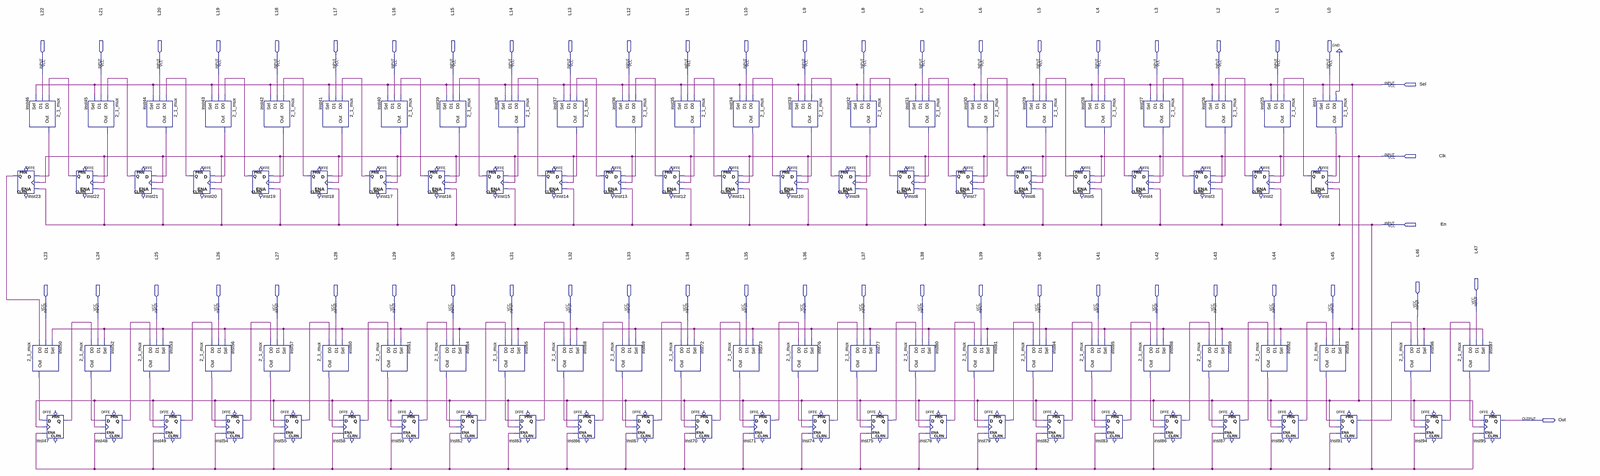
[diagram p0: schematic sheet, whole]
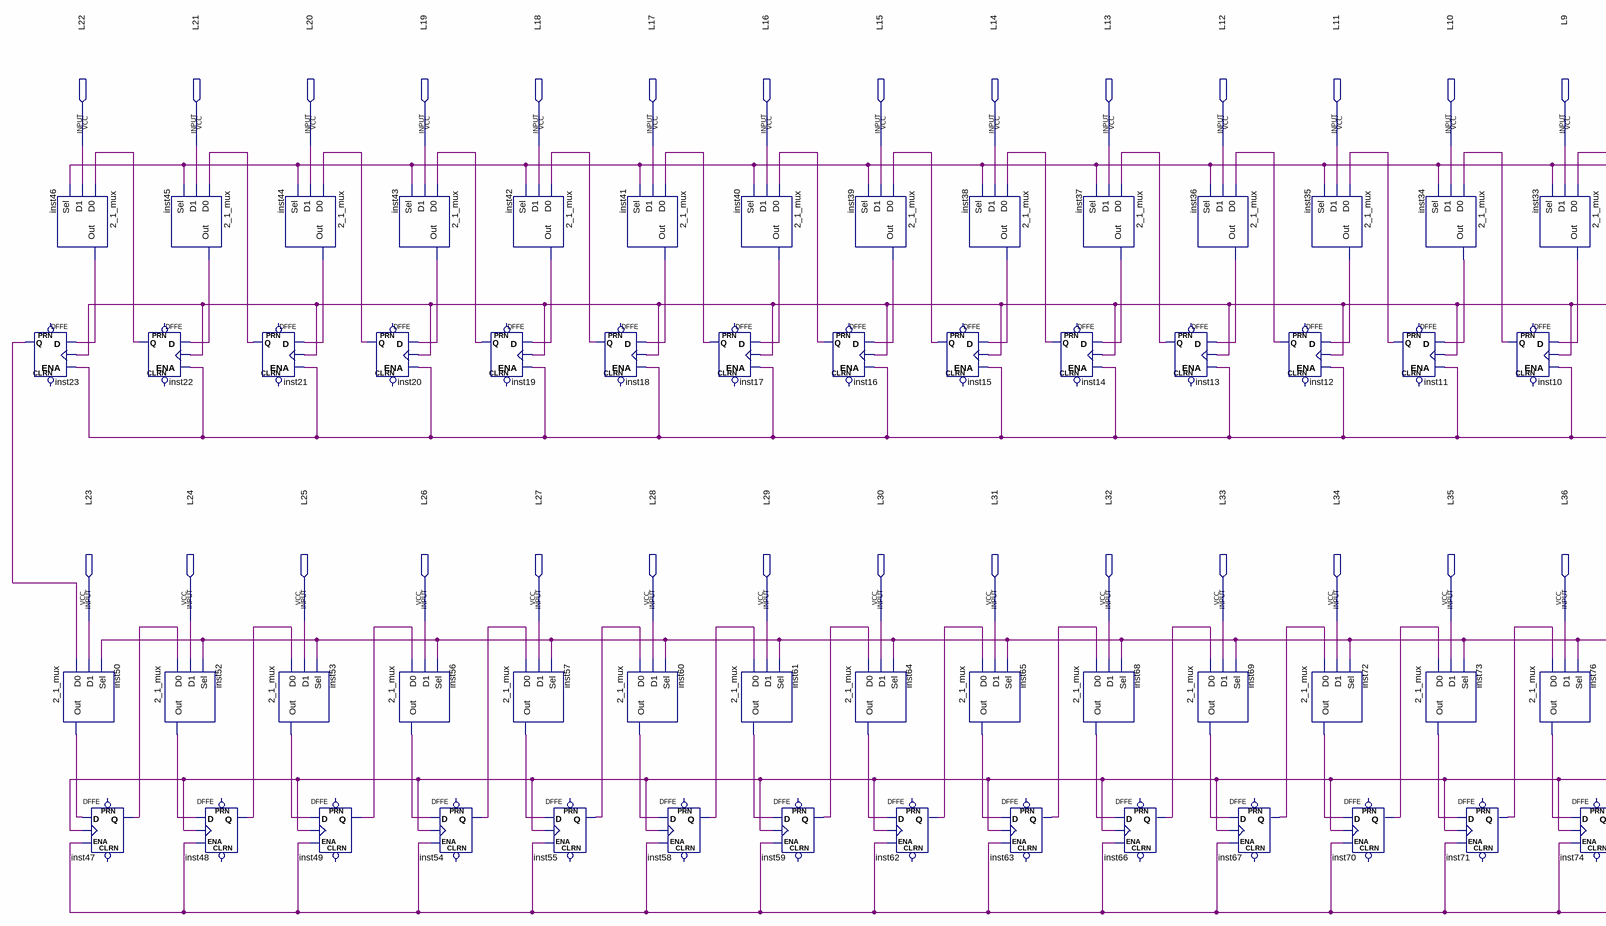
[diagram p1: schematic sheet, left part]
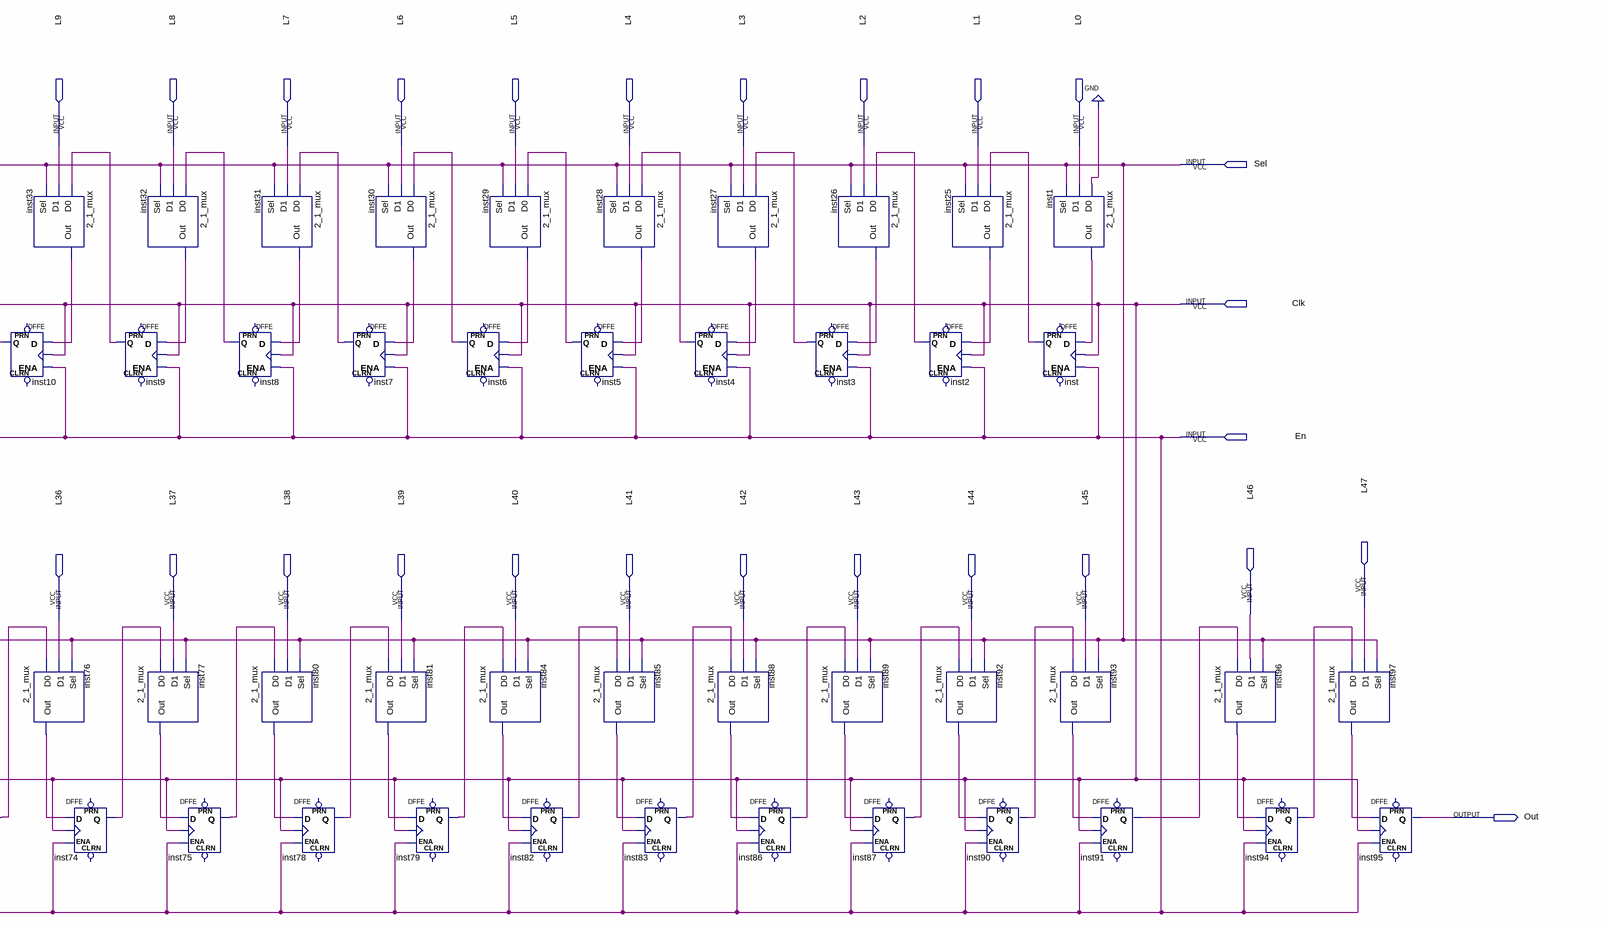
[diagram p2: schematic sheet, right part]
// Quartus schematic 46_bit_par_in_ser_out_reg.bdf as structural Verilog: 96 symbols, 52 pins
module \46_bit_par_in_ser_out_reg  (
  input  L22,
  input  L21,
  input  L20,
  input  L19,
  input  L18,
  input  L17,
  input  L16,
  input  L15,
  input  L14,
  input  L13,
  input  L12,
  input  L11,
  input  L10,
  input  L9,
  input  L8,
  input  L7,
  input  L6,
  input  L5,
  input  L4,
  input  L3,
  input  L2,
  input  L1,
  input  L0,
  input  Sel,
  input  Clk,
  input  En,
  input  L47,
  input  L46,
  input  L23,
  input  L24,
  input  L25,
  input  L26,
  input  L27,
  input  L28,
  input  L29,
  input  L30,
  input  L31,
  input  L32,
  input  L33,
  input  L34,
  input  L35,
  input  L36,
  input  L37,
  input  L38,
  input  L39,
  input  L40,
  input  L41,
  input  L42,
  input  L43,
  input  L44,
  input  L45,
  output Out
);

  wire inst1_out, inst2_q, inst3_q, inst4_q, inst5_q, inst6_q, inst7_q, inst8_q, inst9_q, inst10_q, inst11_q,
       inst12_q, inst13_q, inst14_q, inst15_q, inst16_q, inst17_q, inst18_q, inst19_q, inst20_q, inst21_q,
       inst22_q, inst23_q, inst25_out, inst26_out, inst27_out, inst28_out, inst29_out, inst30_out,
       inst31_out, inst32_out, inst33_out, inst34_out, inst35_out, inst36_out, inst37_out, inst38_out,
       inst39_out, inst40_out, inst41_out, inst42_out, inst43_out, inst44_out, inst45_out, inst46_out,
       inst47_q, inst48_q, inst49_q, inst50_out, inst52_out, inst53_out, inst54_q, inst55_q, inst56_out,
       inst57_out, inst58_q, inst59_q, inst60_out, inst61_out, inst62_q, inst63_q, inst64_out, inst65_out,
       inst66_q, inst67_q, inst68_out, inst69_out, inst70_q, inst71_q, inst72_out, inst73_out, inst74_q,
       inst75_q, inst76_out, inst77_out, inst78_q, inst79_q, inst80_out, inst81_out, inst82_q, inst83_q,
       inst84_out, inst85_out, inst86_q, inst87_q, inst88_out, inst89_out, inst90_q, inst91_q, inst92_out,
       inst93_out, inst94_q, inst96_out, inst97_out, inst_q;

  \2_1_mux  inst46 (.D0(inst22_q), .D1(L22), .Sel(Sel), .Out(inst46_out));
  DFFE inst23 (.D(inst46_out), .CLK(Clk), .ENA(En), .Q(inst23_q));  // open: PRN, CLRN
  \2_1_mux  inst50 (.D0(inst23_q), .D1(L23), .Sel(Sel), .Out(inst50_out));
  DFFE inst47 (.D(inst50_out), .CLK(Clk), .ENA(En), .Q(inst47_q));  // open: PRN, CLRN
  DFFE inst22 (.D(inst45_out), .CLK(Clk), .ENA(En), .Q(inst22_q));  // open: PRN, CLRN
  \2_1_mux  inst45 (.D0(inst21_q), .D1(L21), .Sel(Sel), .Out(inst45_out));
  \2_1_mux  inst52 (.D0(inst47_q), .D1(L24), .Sel(Sel), .Out(inst52_out));
  DFFE inst48 (.D(inst52_out), .CLK(Clk), .ENA(En), .Q(inst48_q));  // open: PRN, CLRN
  \2_1_mux  inst44 (.D0(inst20_q), .D1(L20), .Sel(Sel), .Out(inst44_out));
  DFFE inst21 (.D(inst44_out), .CLK(Clk), .ENA(En), .Q(inst21_q));  // open: PRN, CLRN
  \2_1_mux  inst53 (.D0(inst48_q), .D1(L25), .Sel(Sel), .Out(inst53_out));
  DFFE inst49 (.D(inst53_out), .CLK(Clk), .ENA(En), .Q(inst49_q));  // open: PRN, CLRN
  \2_1_mux  inst43 (.D0(inst19_q), .D1(L19), .Sel(Sel), .Out(inst43_out));
  DFFE inst20 (.D(inst43_out), .CLK(Clk), .ENA(En), .Q(inst20_q));  // open: PRN, CLRN
  \2_1_mux  inst56 (.D0(inst49_q), .D1(L26), .Sel(Sel), .Out(inst56_out));
  DFFE inst54 (.D(inst56_out), .CLK(Clk), .ENA(En), .Q(inst54_q));  // open: PRN, CLRN
  \2_1_mux  inst42 (.D0(inst18_q), .D1(L18), .Sel(Sel), .Out(inst42_out));
  DFFE inst19 (.D(inst42_out), .CLK(Clk), .ENA(En), .Q(inst19_q));  // open: PRN, CLRN
  \2_1_mux  inst57 (.D0(inst54_q), .D1(L27), .Sel(Sel), .Out(inst57_out));
  DFFE inst55 (.D(inst57_out), .CLK(Clk), .ENA(En), .Q(inst55_q));  // open: PRN, CLRN
  DFFE inst18 (.D(inst41_out), .CLK(Clk), .ENA(En), .Q(inst18_q));  // open: PRN, CLRN
  \2_1_mux  inst41 (.D0(inst17_q), .D1(L17), .Sel(Sel), .Out(inst41_out));
  \2_1_mux  inst60 (.D0(inst55_q), .D1(L28), .Sel(Sel), .Out(inst60_out));
  DFFE inst58 (.D(inst60_out), .CLK(Clk), .ENA(En), .Q(inst58_q));  // open: PRN, CLRN
  \2_1_mux  inst40 (.D0(inst16_q), .D1(L16), .Sel(Sel), .Out(inst40_out));
  DFFE inst17 (.D(inst40_out), .CLK(Clk), .ENA(En), .Q(inst17_q));  // open: PRN, CLRN
  \2_1_mux  inst61 (.D0(inst58_q), .D1(L29), .Sel(Sel), .Out(inst61_out));
  DFFE inst59 (.D(inst61_out), .CLK(Clk), .ENA(En), .Q(inst59_q));  // open: PRN, CLRN
  \2_1_mux  inst39 (.D0(inst15_q), .D1(L15), .Sel(Sel), .Out(inst39_out));
  DFFE inst16 (.D(inst39_out), .CLK(Clk), .ENA(En), .Q(inst16_q));  // open: PRN, CLRN
  \2_1_mux  inst64 (.D0(inst59_q), .D1(L30), .Sel(Sel), .Out(inst64_out));
  DFFE inst62 (.D(inst64_out), .CLK(Clk), .ENA(En), .Q(inst62_q));  // open: PRN, CLRN
  \2_1_mux  inst38 (.D0(inst14_q), .D1(L14), .Sel(Sel), .Out(inst38_out));
  DFFE inst15 (.D(inst38_out), .CLK(Clk), .ENA(En), .Q(inst15_q));  // open: PRN, CLRN
  \2_1_mux  inst65 (.D0(inst62_q), .D1(L31), .Sel(Sel), .Out(inst65_out));
  DFFE inst63 (.D(inst65_out), .CLK(Clk), .ENA(En), .Q(inst63_q));  // open: PRN, CLRN
  DFFE inst14 (.D(inst37_out), .CLK(Clk), .ENA(En), .Q(inst14_q));  // open: PRN, CLRN
  \2_1_mux  inst37 (.D0(inst13_q), .D1(L13), .Sel(Sel), .Out(inst37_out));
  \2_1_mux  inst68 (.D0(inst63_q), .D1(L32), .Sel(Sel), .Out(inst68_out));
  DFFE inst66 (.D(inst68_out), .CLK(Clk), .ENA(En), .Q(inst66_q));  // open: PRN, CLRN
  \2_1_mux  inst36 (.D0(inst12_q), .D1(L12), .Sel(Sel), .Out(inst36_out));
  DFFE inst13 (.D(inst36_out), .CLK(Clk), .ENA(En), .Q(inst13_q));  // open: PRN, CLRN
  \2_1_mux  inst69 (.D0(inst66_q), .D1(L33), .Sel(Sel), .Out(inst69_out));
  DFFE inst67 (.D(inst69_out), .CLK(Clk), .ENA(En), .Q(inst67_q));  // open: PRN, CLRN
  \2_1_mux  inst35 (.D0(inst11_q), .D1(L11), .Sel(Sel), .Out(inst35_out));
  DFFE inst12 (.D(inst35_out), .CLK(Clk), .ENA(En), .Q(inst12_q));  // open: PRN, CLRN
  \2_1_mux  inst72 (.D0(inst67_q), .D1(L34), .Sel(Sel), .Out(inst72_out));
  DFFE inst70 (.D(inst72_out), .CLK(Clk), .ENA(En), .Q(inst70_q));  // open: PRN, CLRN
  \2_1_mux  inst34 (.D0(inst10_q), .D1(L10), .Sel(Sel), .Out(inst34_out));
  DFFE inst11 (.D(inst34_out), .CLK(Clk), .ENA(En), .Q(inst11_q));  // open: PRN, CLRN
  \2_1_mux  inst73 (.D0(inst70_q), .D1(L35), .Sel(Sel), .Out(inst73_out));
  DFFE inst71 (.D(inst73_out), .CLK(Clk), .ENA(En), .Q(inst71_q));  // open: PRN, CLRN
  DFFE inst10 (.D(inst33_out), .CLK(Clk), .ENA(En), .Q(inst10_q));  // open: PRN, CLRN
  \2_1_mux  inst33 (.D0(inst9_q), .D1(L9), .Sel(Sel), .Out(inst33_out));
  \2_1_mux  inst76 (.D0(inst71_q), .D1(L36), .Sel(Sel), .Out(inst76_out));
  DFFE inst74 (.D(inst76_out), .CLK(Clk), .ENA(En), .Q(inst74_q));  // open: PRN, CLRN
  \2_1_mux  inst32 (.D0(inst8_q), .D1(L8), .Sel(Sel), .Out(inst32_out));
  DFFE inst9 (.D(inst32_out), .CLK(Clk), .ENA(En), .Q(inst9_q));  // open: PRN, CLRN
  \2_1_mux  inst77 (.D0(inst74_q), .D1(L37), .Sel(Sel), .Out(inst77_out));
  DFFE inst75 (.D(inst77_out), .CLK(Clk), .ENA(En), .Q(inst75_q));  // open: PRN, CLRN
  \2_1_mux  inst31 (.D0(inst7_q), .D1(L7), .Sel(Sel), .Out(inst31_out));
  DFFE inst8 (.D(inst31_out), .CLK(Clk), .ENA(En), .Q(inst8_q));  // open: PRN, CLRN
  \2_1_mux  inst80 (.D0(inst75_q), .D1(L38), .Sel(Sel), .Out(inst80_out));
  DFFE inst78 (.D(inst80_out), .CLK(Clk), .ENA(En), .Q(inst78_q));  // open: PRN, CLRN
  \2_1_mux  inst30 (.D0(inst6_q), .D1(L6), .Sel(Sel), .Out(inst30_out));
  DFFE inst7 (.D(inst30_out), .CLK(Clk), .ENA(En), .Q(inst7_q));  // open: PRN, CLRN
  \2_1_mux  inst81 (.D0(inst78_q), .D1(L39), .Sel(Sel), .Out(inst81_out));
  DFFE inst79 (.D(inst81_out), .CLK(Clk), .ENA(En), .Q(inst79_q));  // open: PRN, CLRN
  DFFE inst6 (.D(inst29_out), .CLK(Clk), .ENA(En), .Q(inst6_q));  // open: PRN, CLRN
  \2_1_mux  inst29 (.D0(inst5_q), .D1(L5), .Sel(Sel), .Out(inst29_out));
  \2_1_mux  inst84 (.D0(inst79_q), .D1(L40), .Sel(Sel), .Out(inst84_out));
  DFFE inst82 (.D(inst84_out), .CLK(Clk), .ENA(En), .Q(inst82_q));  // open: PRN, CLRN
  \2_1_mux  inst28 (.D0(inst4_q), .D1(L4), .Sel(Sel), .Out(inst28_out));
  DFFE inst5 (.D(inst28_out), .CLK(Clk), .ENA(En), .Q(inst5_q));  // open: PRN, CLRN
  \2_1_mux  inst85 (.D0(inst82_q), .D1(L41), .Sel(Sel), .Out(inst85_out));
  DFFE inst83 (.D(inst85_out), .CLK(Clk), .ENA(En), .Q(inst83_q));  // open: PRN, CLRN
  \2_1_mux  inst27 (.D0(inst3_q), .D1(L3), .Sel(Sel), .Out(inst27_out));
  DFFE inst4 (.D(inst27_out), .CLK(Clk), .ENA(En), .Q(inst4_q));  // open: PRN, CLRN
  \2_1_mux  inst88 (.D0(inst83_q), .D1(L42), .Sel(Sel), .Out(inst88_out));
  DFFE inst86 (.D(inst88_out), .CLK(Clk), .ENA(En), .Q(inst86_q));  // open: PRN, CLRN
  DFFE inst3 (.D(inst26_out), .CLK(Clk), .ENA(En), .Q(inst3_q));  // open: PRN, CLRN
  \2_1_mux  inst89 (.D0(inst86_q), .D1(L43), .Sel(Sel), .Out(inst89_out));
  \2_1_mux  inst26 (.D0(inst2_q), .D1(L2), .Sel(Sel), .Out(inst26_out));
  DFFE inst87 (.D(inst89_out), .CLK(Clk), .ENA(En), .Q(inst87_q));  // open: PRN, CLRN
  DFFE inst2 (.D(inst25_out), .CLK(Clk), .ENA(En), .Q(inst2_q));  // open: PRN, CLRN
  \2_1_mux  inst25 (.D0(inst_q), .D1(L1), .Sel(Sel), .Out(inst25_out));
  \2_1_mux  inst92 (.D0(inst87_q), .D1(L44), .Sel(Sel), .Out(inst92_out));
  DFFE inst90 (.D(inst92_out), .CLK(Clk), .ENA(En), .Q(inst90_q));  // open: PRN, CLRN
  \2_1_mux  inst1 (.D0(1'b0), .D1(L0), .Sel(Sel), .Out(inst1_out));
  DFFE inst (.D(inst1_out), .CLK(Clk), .ENA(En), .Q(inst_q));  // open: PRN, CLRN
  \2_1_mux  inst93 (.D0(inst90_q), .D1(L45), .Sel(Sel), .Out(inst93_out));
  DFFE inst91 (.D(inst93_out), .CLK(Clk), .ENA(En), .Q(inst91_q));  // open: PRN, CLRN
  \2_1_mux  inst96 (.D0(inst91_q), .D1(L46), .Sel(Sel), .Out(inst96_out));
  DFFE inst94 (.D(inst96_out), .CLK(Clk), .ENA(En), .Q(inst94_q));  // open: PRN, CLRN
  \2_1_mux  inst97 (.D0(inst94_q), .D1(L47), .Sel(Sel), .Out(inst97_out));
  DFFE inst95 (.D(inst97_out), .CLK(Clk), .ENA(En), .Q(Out));  // open: PRN, CLRN
endmodule
